# Altium project Project_2.PrjPcb
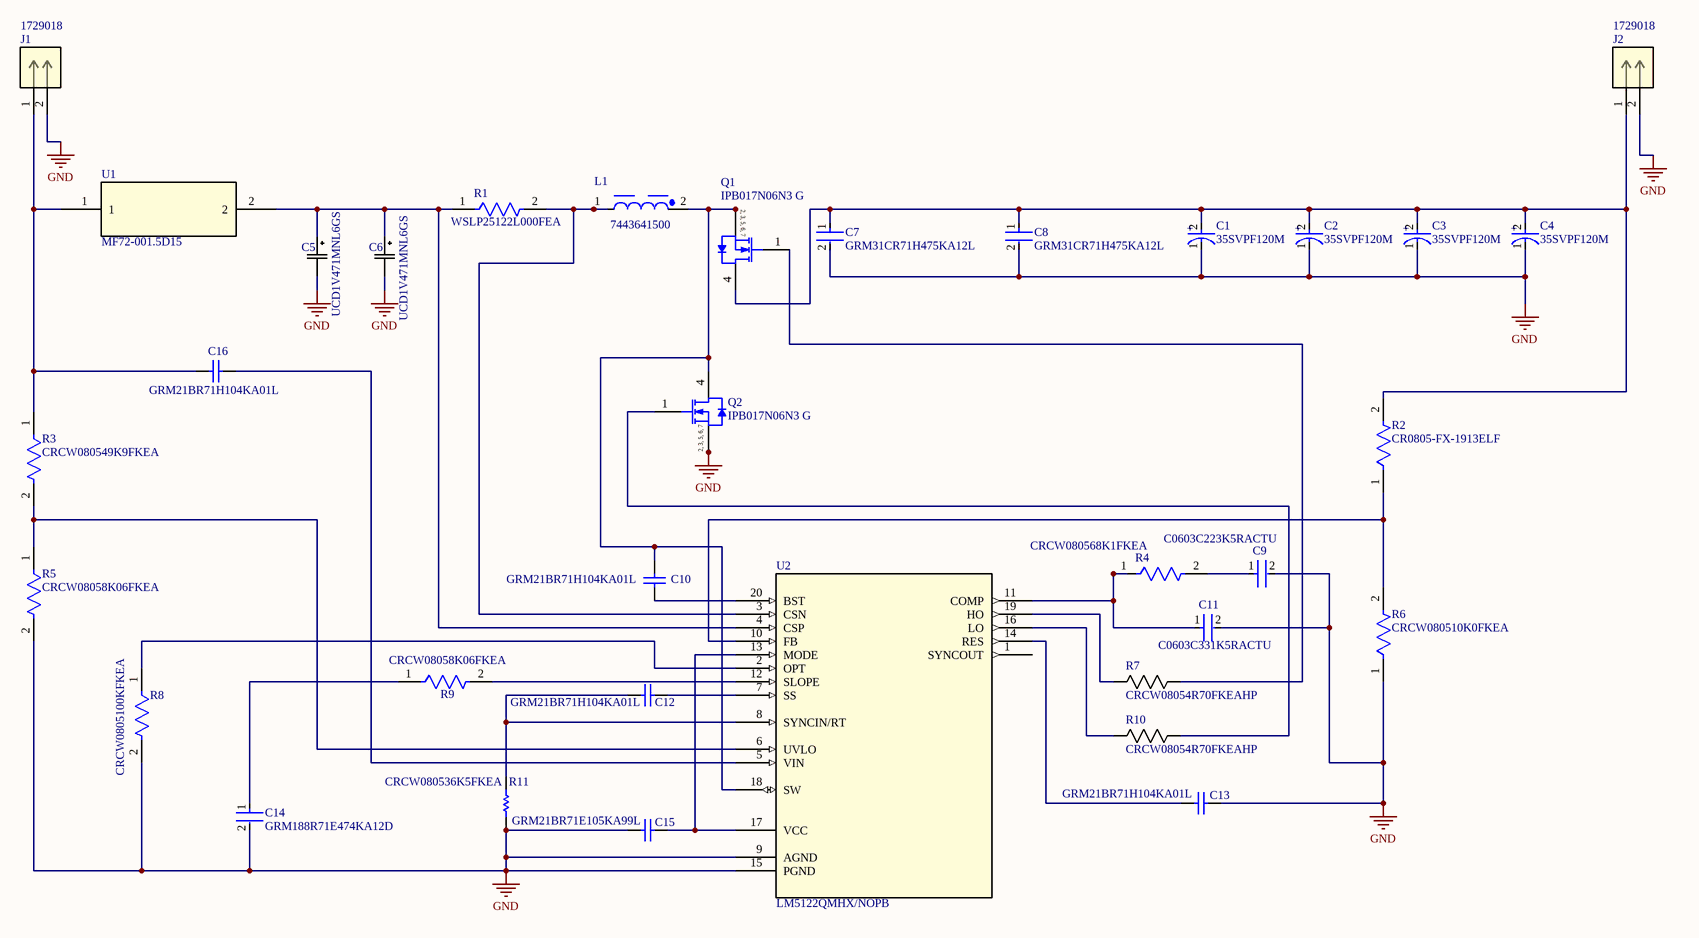
[diagram p0: Sheet2.SchDoc]
1 sheet, 34 parts. Net scope: global (net labels, ports and power ports of the same name join across sheets).
Board file: PCB1.PcbDoc

## Sheet Sheet2.SchDoc
size B; SheetNumber: 1; SheetTotal: 1; SPICEModelCacheEYRHZINW: <root> / <DocumentId>EYRHZINW</DocumentId> / </root>

### Parts
C1  35SVPF120M  [FP-OS-CON-SMT-F12-MFG]
C2  35SVPF120M  [FP-OS-CON-SMT-F12-MFG]
C3  35SVPF120M  [FP-OS-CON-SMT-F12-MFG]
C4  35SVPF120M  [FP-OS-CON-SMT-F12-MFG]
C5  UCD1V471MNL6GS  [CAP_UCD_10X13P5_NCH]
C6  UCD1V471MNL6GS  [CAP_UCD_10X13P5_NCH]
C7  GRM31CR71H475KA12L  [FP-GRM31C-0_2-e0_3_0_8-IPC_C]
C8  GRM31CR71H475KA12L  [FP-GRM31C-0_2-e0_3_0_8-IPC_C]
C9  C0603C223K5RACTU  [FP-C0603C-CF-MFG]
C10  GRM21BR71H104KA01L  [CAPC2013X135X45ML10T25]
C11  C0603C331K5RACTU  [FP-C0603C-CF-MFG]
C12  GRM21BR71H104KA01L  [CAPC2013X135X45ML10T25]
C13  GRM21BR71H104KA01L  [CAPC2013X135X45ML10T25]
C14  GRM188R71E474KA12D  [FP-GRM188-0_1-e0_2_0_5-MFG]
C15  GRM21BR71E105KA99L  [CAPC2013X140X45NL15T25]
C16  GRM21BR71H104KA01L  [CAPC2013X135X45ML10T25]
J1  1729018  [CONN_1729018_PXC]
J2  1729018  [CONN_1729018_PXC]
L1  7443641500  [WE-HCF_2818]
Q1  IPB017N06N3 G  [INF-PG-TO-263-7-2_N]
Q2  IPB017N06N3 G  [INF-PG-TO-263-7-2_N]
R1  WSLP25122L000FEA  [FP-WSLP2512-0R001-0R0049-MFG]
R2  CR0805-FX-1913ELF  [FP-CR0805-IPC_B]
R3  CRCW080549K9FKEA  [FP-CRCW0805-e3-IPC_C]
R4  CRCW080568K1FKEA  [FP-CRCW0805-e3-MFG]
R5  CRCW08058K06FKEA  [FP-CRCW0805-e3-MFG]
R6  CRCW080510K0FKEA  [FP-CRCW0805-e3-IPC_A]
R7  CRCW08054R70FKEAHP  [RES_CRCW_0805_VIS]
R8  CRCW0805100KFKEA  [FP-CRCW0805-e3-MFG]
R9  CRCW08058K06FKEA  [FP-CRCW0805-e3-MFG]
R10  CRCW08054R70FKEAHP  [RES_CRCW_0805_VIS]
R11  CRCW080536K5FKEA  [RESC2013X50X30ML20T20]
U1  MF72-001.5D15  [MF72-001.5D15_CTM]
U2  LM5122QMHX/NOPB  [PWP20_3P0X4P2-M]

### Nets
GND: C1.1(C) C2.1(C) C3.1(C) C4.1(C) C5.2 C6.2 C7.2 C8.2 C9.2 C11.2 C13.2 C14.2 C15.1 J1.2 J2.2 Q2.2(SOURCE) Q2.3(SOURCE) Q2.5(SOURCE) Q2.6(SOURCE) Q2.7(SOURCE) R5.2 R6.1 R8.2 R11.1 U2.9(AGND) U2.15(PGND)
NetC1_2: C1.2(A) C2.2(A) C3.2(A) C4.2(A) C7.1 C8.1 J2.1 Q1.4(DRAIN) R2.2
NetC5_1: C5.1 C6.1 R1.1 U1.2 U2.4(CSP)
NetC9_1: C9.1 R4.2
NetC10_1: C10.1 L1.2 Q1.2(SOURCE) Q1.3(SOURCE) Q1.5(SOURCE) Q1.6(SOURCE) Q1.7(SOURCE) Q2.4(DRAIN) U2.18(SW)
NetC10_2: C10.2 U2.20(BST)
NetC11_1: C11.1 R4.1 U2.11(COMP)
NetC12_1: C12.1 R11.2 U2.8(SYNCIN/RT)
NetC12_2: C12.2 U2.7(SS)
NetC13_1: C13.1 U2.14(RES)
NetC14_1: C14.1 R9.1
NetC15_2: C15.2 U2.13(MODE) U2.17(VCC)
NetC16_1: C16.1 J1.1 R3.1 U1.1
NetC16_2: C16.2 U2.5(VIN)
NetL1_1: L1.1 R1.2 U2.3(CSN)
NetQ1_1: Q1.1(GATE) R7.1
NetQ2_1: Q2.1(GATE) R10.1
NetR2_1: R2.1 R6.2 U2.10(FB)
NetR3_2: R3.2 R5.1 U2.6(UVLO)
NetR7_2: R7.2 U2.19(HO)
NetR8_1: R8.1 U2.2(OPT)
NetR9_2: R9.2 U2.12(SLOPE)
NetR10_2: R10.2 U2.16(LO)

Not connected (* = marked no-connect by the designer): U2 1(SYNCOUT)

### Notes on the sheet
- (in symbol CMP-1091-00282-1) 2, 3, 5, 6, 7
- (in symbol CMP-05428-000082-1) +

### Library data of the parts
C1-C4 = CMP-05428-000082-1: Conductive Polymer Aluminum Solid Capacitors (OS-CON) 120uF ±20% 35V RADIAL SMT 10x12.6mm; Life (Hours): 5000Hour; Ripple Current: 4.4A; Polarity: Polar; ESR (Equivalent Series Resistance): 18mR; Dissipation Factor: 12%; Leakage Current: 840uA; REACH SVHC: No SVHC; Length: 12.6mm; Capacitance: 120uF; Series: OS-CON™, SVPF; Case/Package: Radial; Number of Pins: 12; Min Operating Temperature: -55°C; Package Quantity: 400; Height: 12.6mm; Voltage Rating: 35V; Lead Free: Lead Free; Max Operating Temperature: 105°C; Voltage: 35V; Mount: Surface Mount; Packaging: Tape and Reel; Voltage Rating (DC): 35V; RoHS Compliant: Yes; Height - Seated (Max): 0.5inch; Tolerance: 20%; Diameter: 10mm; Termination: SMD/SMT; Ripple Current (AC): 4.4A
C5 C6 = UCD1V471MNL6GS: No Description Available; Manufacturer_Name: Nichicon; Copyright: Copyright (C) 2026 Ultra Librarian. All rights reserved.; Manufacturer_Part_Number: UCD1V471MNL6GS
C7 C8 = CMP-1037-04923-3: Chip Multilayer Ceramic Capacitors for General Purpose, 1206, 4.7uF, X7R, 15%, 10%, 50V; Height: 1.6mm; Voltage: 50V; Capacitance: 4.7uF; Lead Free: Lead Free; Max Operating Temperature: 125°C; Packaging: Tape and Reel; REACH SVHC: No SVHC; Voltage Rating: 50V; Mount: Surface Mount; Termination: SMD/SMT; Tolerance: 10%; Case/Package: 1206; Material: Ceramic; Depth: 1.6mm; Length: 3.2mm; Case Code (Metric): 3216; Voltage Rating (DC): 50V; Case Code (Imperial): 1206; Radiation Hardening: No; Width: 0.063inch; Thickness: 0.071inch; Package Quantity: 2000; Min Operating Temperature: -55°C; Dielectric: X7R
C9 = CMP-2006-03879-3: Ceramic Capacitor 0.022Uf 50V, X7R, 10%, 0603, Full Reel; Manufacturer: KEMET; Automotive Grade: Grade 1; Capacitance: 22,000 pF; Value: 22,000 pF; Tolerance: 0.1; Temperature Coefficient: 30ppm/°C; Material: Ceramic; Mouser Description: Capacitor; Ceramic; Cap; .022uF; Tol+10%; SMT; Vol-Rtg 50V; X7R; TR; Voltage Rating: 50 V; Category: Cap; Device Class L2: Capacitors; RoHS: TRUE; Package: C0603C-CF; Device Class L1: Passive Components; Temperature Range Low: -55°C; Octopart: https://octopart.com/c0603c223k5ractu-kemet-97352; Manufacturer Part Number: C0603C223K5RACTU; Temperature: -55°C to +125°C; Temperature Range High: +125°C; Automotive: Yes; Lead Free: Yes; ComponentLink2URL: https://api.kemet.com/component-edge/download/datasheet/C0603C100J5GACAUTO.pdf; Temperature Characteristic: X7R; Height: 0.87mm; Device Class L3: Ceramic Capacitors; Digikey Description: Ceramic Capacitor 0.022Uf 50V, X7R, 10%, 0603, Full Reel; ComponentLink2Description: Datasheet
C10 C12 C13 C16 = CMP-2100-03644-1: Chip Capacitor, 0.1 uF, +/- 10%, 50 V, -55 to 125 degC, 0805 (2012 Metric), RoHS, Tape and Reel; Manufacturer: Murata; Voltage: 50V; Capacitance: 100nF; Insulation Resistance: 10GR; Dielectric Material: Ceramic; Dielectric: X7R; Package Description: 2-Pin Surface Mount Device, Body 2 x 1.25 mm; Manufacturer URL: http://www.murata.com/; Case Code (Imperial): 0805; Datasheet URL: http://psearch.en.murata.com/capacitor/product/GRM21BR71H104KA01%23.pdf; Termination: SMD/SMT; Lead Free: LeadFree; Package Quantity: 1; Mount: SurfaceMount; REACH SVHC: Unknown; Thickness: 0.053inch; Height: 1.25mm; Case/Package: 0805; Voltage Rating: 50V; Width: 0.049inch; Case Code (Metric): 2012; Material: Ceramic; Min Operating Temperature: -55degC; RoHSCompliant: true; Datasheet Version: 42675.0; Voltage Rating (DC): 50V; Tolerance: 10%; Package Reference: 0805; Depth: 1.25mm; Length: 2mm; Max Operating Temperature: 125degC; Packaging: TapeandReel; Number of Pins: 2; Radiation Hardening: No
C11 = CMP-2006-03173-2: CAP CER 330PF 50V X7R 0603; Manufacturer: KEMET; Tolerance: 0.1; Temperature Coefficient: 30ppm/°C; Automotive Grade: Grade 1; Material: Ceramic; Value: 330 pF; Automotive: Yes; Voltage Rating: 50 V; Temperature Characteristic: X7R; Device Class L1: Passive Components; Category: Cap; ComponentLink2URL: https://api.kemet.com/component-edge/download/datasheet/C0603C100J5GACAUTO.pdf; Capacitance: 330 pF; Manufacturer Part Number: C0603C331K5RACTU; Temperature Range Low: -55°C; Temperature: -55°C to +125°C; Lead Free: Yes; ComponentLink2Description: Datasheet; Digikey Description: CAP CER 330PF 50V X7R 0603; Device Class L3: Ceramic Capacitors; Height: 0.87mm; Package: C0603C-CF; Temperature Range High: +125°C; Device Class L2: Capacitors; Mouser Description: Multilayer Ceramic Capacitors MLCC - SMD/SMT 50volts 330pF X7R 10%; Octopart: https://octopart.com/c0603c331k5ractu-kemet-132411; RoHS: TRUE
C14 = CMP-06035-003857-1: Chip Multilayer Ceramic Capacitors for General Purpose, 0603, 0.47uF, X7R, 15%, 10%, 25V; Capacitance: 470nF; Voltage: 50V; Case Code (Imperial): 0603; Mount: Surface Mount; Material: Ceramic; Case/Package: 0603; Thickness: 0.035inch; Tolerance: 10%; Length: 1.6mm; Lead Free: Lead Free; Voltage Rating: 25V; Width: 0.031inch; Voltage Rating (DC): 25V; Dielectric: X7R; Case Code (Metric): 1608; Number of Pins: 2; Termination: SMD/SMT; REACH SVHC: No SVHC; Min Operating Temperature: -55°C; Max Operating Temperature: 125°C; Depth: 0.8mm; Height: 0.8mm; Package Quantity: 4000; Packaging: Tape and Reel
C15 = CMP-2007-03403-1: Manufacturer: Murata; Part Number: GRM21BR71E105KA99L
J1 J2 = 1729018: PCB terminal block, nominal current: 13.5 A, nom. voltage: 400 V, pitch: 5 mm, number of positions: 2, connection method: Screw connection with tension sleeve, mounting: Wave soldering, conductor/PCB connection direction: 0 Â°, color: green; Manufacturer_Name: Phoenix Contact; Copyright: Copyright (C) 2025 Ultra Librarian. All rights reserved.; Manufacturer_Part_Number: 1729018; RefDes: RefDes; Type: Type
L1 = CMP-1378-00012-4: PowerChoke Shielded Wirewound 15uH 15% 100KHz Ferrite 30A 0.00264Ohm DCR Automotive Tray; Inductance: 15µH; Self Resonant Frequency: 11MHz; Series Resistance: 2.4mΩ; Saturation Current: 22A; Tolerance: 15%; Number of Pins: 2; Max Operating Temperature: 125°C; Min Operating Temperature: -40°C; Termination: SMD/SMT; Inductance Tolerance: 15%; Composition: Wirewound; Packaging: Cut Tape; Height: 18.5mm; Ambient Temperature Range Low: -40°C; REACH SVHC: Unknown; Height - Seated (Max): 18.4912mm; Max DC Current: 30A; DC Resistance (DCR): 2.4mΩ; Current Rating: 30A; RMS Current (Irms): 30A; Test Frequency: 100kHz; RoHS: Compliant; Width: 28mm; Length: 27mm; Case/Package: Nonstandard; Shielding: Shielded; Mount: Surface Mount; Core Material: Ferrite; Ambient Temperature Range High: 75°C
Q1 Q2 = CMP-1091-00282-1: N-Channel OptiMOS 3 Power-Transistor, 60 V VDS, 180 A ID, -55 to 175 degC, PG-TO-263-7-2, Reel, Green; Manufacturer: Infineon; Rth: 0.6Â K/W; IDpuls (max): 720Â A; Ptot (max): 250Â W; QG: 206Â nC; Green: TRUE; Polarity: N; RthJA (max): 62 K/W; VDS (max): 60Â V; RDS (on) (max): 1.7Â mOhm; VGS(th) (max): 4Â V; ID (max): 180Â A; VGS(th) (min): 2Â V; DatasheetVersion: Rev. 2.2; Packing: Reel; ComponentLink2Description: Datasheet; PackageReference: PG-TO-263-7-2; PackageVersion: Rev. 01, 11/2007; RthJC (max): 0.6Â K/W; PackageDescription: 7-Pin Plastic (Green) Transistor Single Outline Package, 10.1 x 8.98 mm Body, 1.27 mm Pitch; ComponentLink3Description: Package Specification; ComponentLink2URL: http://www.infineon.com/dgdl/IPB017N06N3_Rev2.2.pdf?folderId=db3a30431441fb5d01148ca9f1be0e77&fileId=db3a30431ddc9372011e264a7ab746ea; Mounting Technology: Surface Mount; Halogen-free: TRUE; PartNumber: IPB017N06N3 G; ComponentLink1Description: Manufacturer URL; ComponentLink3URL: http://www.infineon.com/dgdl/BTS621L1_20030922.pdf?folderId=db3a30431400ef68011421b54e2e0564&fileId=db3a304333227b5e0133258247c72ecc&sId=db3a30433d68e984013d8539603e0d72; ComponentLink1URL: http://www.infineon.com/
R1 = CMP-02407-010958-1: RES 0.002 OHM 1% 3W 2512; Resistance: 2MR; Temperature Coefficient: 275ppm/°C; Size Code: 2512; Width: 3.2mm; Resistor Type: Metal Strip; Packaging: Tape and Reel; Weight: 0.001429oz; RoHS Compliant: Yes; Case Code (Metric): 6432; Case/Package: 2512; Tolerance: 1%; Length: 6.4mm; Case Code (Imperial): 2512; Power Rating: 3W; Min Operating Temperature: -65°C; Mount: Surface Mount; Max Operating Temperature: 170°C; Package Quantity: 2000; Series: WSLP; Height: 0.635mm; Termination: SMD/SMT; Lead Free: Lead Free
R2 = CMP-07231-000644-1: Thick Film Chip Resistors 0805 191kΩ 0.125W 1% 100ppm/°C; Resistance: 191kR; Power Rating: 125mW; Voltage Rating: 150V; Case Code (Imperial): 0805; Thickness: 508um; Max Operating Temperature: 155°C; Width: 1.25mm; Mount: Surface Mount; Tolerance: 1%; Package Quantity: 5000; Temperature Coefficient: 100ppm/°C; Case Code (Metric): 2012; Height: 0.5mm; Length: 2mm; Contact Plating: Tin; Case/Package: 0805; Termination: SMD/SMT; Composition: Thick Film; Military Standard: Not; Min Operating Temperature: -55°C; Depth: 1.25mm; Packaging: Tape and Reel
R3 = CMP-2001-03952-2: RES Thick Film, 49.9kΩ, 1%, 0.125W, 100ppm/°C, 0805; Resistance: 49.9kR; Power Rating: 125mW; Voltage Rating (DC): 150V; Contact Plating: Tin; Case Code (Imperial): 0805; Package Quantity: 10; Termination: SMD/SMT; Length: 2mm; Width: 0.049inch; Case Code (Metric): 2012; Temperature Coefficient: 100ppm/°C; Tolerance: 1%; Depth: 1.25mm; Mount: Surface Mount; Lead Free: Lead Free; Min Operating Temperature: -55°C; Case/Package: 0805; Number of Terminations: 2; Composition: Thick Film; Height: 0.45mm; Voltage Rating: 150V; Max Power Dissipation: 125mW; Features: Automotive AEC-Q200; Military Standard: Not; Radiation Hardening: No; Max Operating Temperature: 155°C; Weight: 0.000194oz; Packaging: Tape and Reel
R4 = CMP-2001-04074-2: RES Thick Film, 68.1kΩ, 1%, 0.125W, 100ppm/°C, 0805; Resistance: 68.1kR; Voltage Rating: 150V; Max Power Dissipation: 125mW; Case/Package: 0805; Tolerance: 1%; Military Standard: Not; Max Operating Temperature: 155°C; Case Code (Imperial): 0805; Packaging: Tape and Reel; Min Operating Temperature: -55°C; Temperature Coefficient: 100ppm/°C; Depth: 1.25mm; Size Code: 0805; RoHS Compliant: Yes; Voltage Rating (DC): 150V; Resistance Tolerance: 1%; Contact Plating: Tin; Lead Free: Lead Free; Features: Automotive AEC-Q200; Number of Terminations: 2; Package Quantity: 10; Width: 0.049inch; Radiation Hardening: No; Construction: Rectangular; Number of Pins: 2; Series: CRCW; Weight: 0.000194oz; Case Code (Metric): 2012; Length: 2mm; Resistor Type: Thick Film; Technology: THICK FILM; Termination: SMD/SMT; Height: 0.45mm; Power Rating: 125mW
R5 R9 = CMP-1013-00612-3: RES Thick Film, 8.06kΩ, 1%, 0.125W, 100ppm/°C, 0805; Resistance: 8.06kR; Voltage Rating: 150V; Power Rating: 125mW; Number of Terminations: 2; Temperature Coefficient: 100ppm/°C; Lead Free: Lead Free; Length: 2mm; Min Operating Temperature: -55°C; Composition: Thick Film; Military Standard: Not; Radiation Hardening: No; Case Code (Imperial): 0805; Depth: 1.25mm; Case Code (Metric): 2012; Package Quantity: 10; Case/Package: 0805; Width: 0.049inch; Max Operating Temperature: 155°C; Weight: 0.000194oz; Termination: SMD/SMT; Packaging: Tape and Reel; Tolerance: 1%; Height: 0.45mm; Features: Automotive AEC-Q200; Voltage Rating (DC): 150V; Contact Plating: Tin; Max Power Dissipation: 125mW; Mount: Surface Mount
R6 = CMP-2001-04908-2: RES Thick Film, 10kΩ, 1%, 0.125W, 100ppm/°C, 0805; Resistance: 10kR; Voltage Rating (DC): 150V; Power Rating: 125mW; Weight: 0.000194oz; Package Quantity: 5000; Military Standard: Not; Max Operating Temperature: 155°C; Temperature Coefficient: 100ppm/°C; Contact Plating: Tin; Width: 1.25mm; Height: 0.45mm; Radiation Hardening: No; Tolerance: 1%; Min Operating Temperature: -55°C; Voltage Rating: 150V; Length: 2mm; Depth: 1.25mm; Termination: SMD/SMT; Packaging: Tape and Reel; Case/Package: 0805; Case Code (Metric): 2012; Lead Free: Lead Free; Case Code (Imperial): 0805; Composition: Thick Film
R7 R10 = CRCW08054R70FKEAHP: CRCW0805-HP 100 4R7 1% ET1 E3; Manufacturer_Name: Vishay; Copyright: Copyright (C) 2025 Ultra Librarian. All rights reserved.; Manufacturer_Part_Number: CRCW08054R70FKEAHP
R8 = CMP-2001-04899-2: RES Thick Film, 100kΩ, 1%, 0.125W, 100ppm/°C, 0805; Resistance: 100kR; Power Rating: 125mW; Voltage Rating: 150V; Case/Package: 0805; Max Operating Temperature: 155°C; Case Code (Imperial): 0805; Lead Free: Lead Free; Weight: 0.000194oz; Number of Pins: 2; Package Quantity: 5000; Height: 0.45mm; Composition: Thick Film; Military Standard: Not; Tolerance: 1%; Case Code (Metric): 2012; Termination: SMD/SMT; Mount: Surface Mount; Radiation Hardening: No; Width: 1.25mm; Length: 2mm; Depth: 1.25mm; Packaging: Tape and Reel; Min Operating Temperature: -55°C; Contact Plating: Tin; Temperature Coefficient: 100ppm/°C; Voltage Rating (DC): 150V
R11 = CMP-1013-00686-2: Manufacturer: Vishay Dale; Part Number: CRCW080536K5FKEA
U1 = MF72-001.5D15: Description; Manufacturer_Name: CANTHERM; Copyright: Copyright (C) 2026 Ultra Librarian. All rights reserved.; Manufacturer_Part_Number: MF72-001.5D15; RefDes: RefDes; Type: Type
U2 = LM5122QMHXNOPB: Automotive, 3-V to 65-V wide VIN, current mode synchronous boost controller with multiphase 20-HTSSOP -40 to 125; Manufacturer_Name: Texas Instruments; Copyright: Copyright (C) 2026 Ultra Librarian. All rights reserved.; Manufacturer_Part_Number: LM5122QMHX/NOPB; RefDes: RefDes; Type: Type